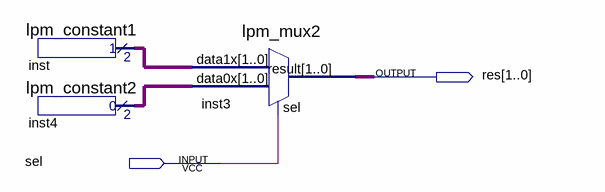
[diagram p0: schematic sheet]
// Quartus schematic bit_to_vec.bdf as structural Verilog: 3 symbols, 2 pins
module bit_to_vec (
  input  sel,
  output [1:0] res
);

  wire [1:0] inst4_result, inst_result;

  lpm_constant1 inst (.result(inst_result));
  lpm_constant2 inst4 (.result(inst4_result));
  lpm_mux2 inst3 (.data1x(inst_result), .data0x(inst4_result), .sel(sel), .result(res));
endmodule
